# EasyEDA schematic SCH_Satlla_4_Solar_unit_left_2023-01-29.json
TITLE: Solar_Unit_110x50; REV: 1.0; Date: 2021-01-31; Sheet: 1/1; Drawn By: KCG LAB; Company: KCG LAB
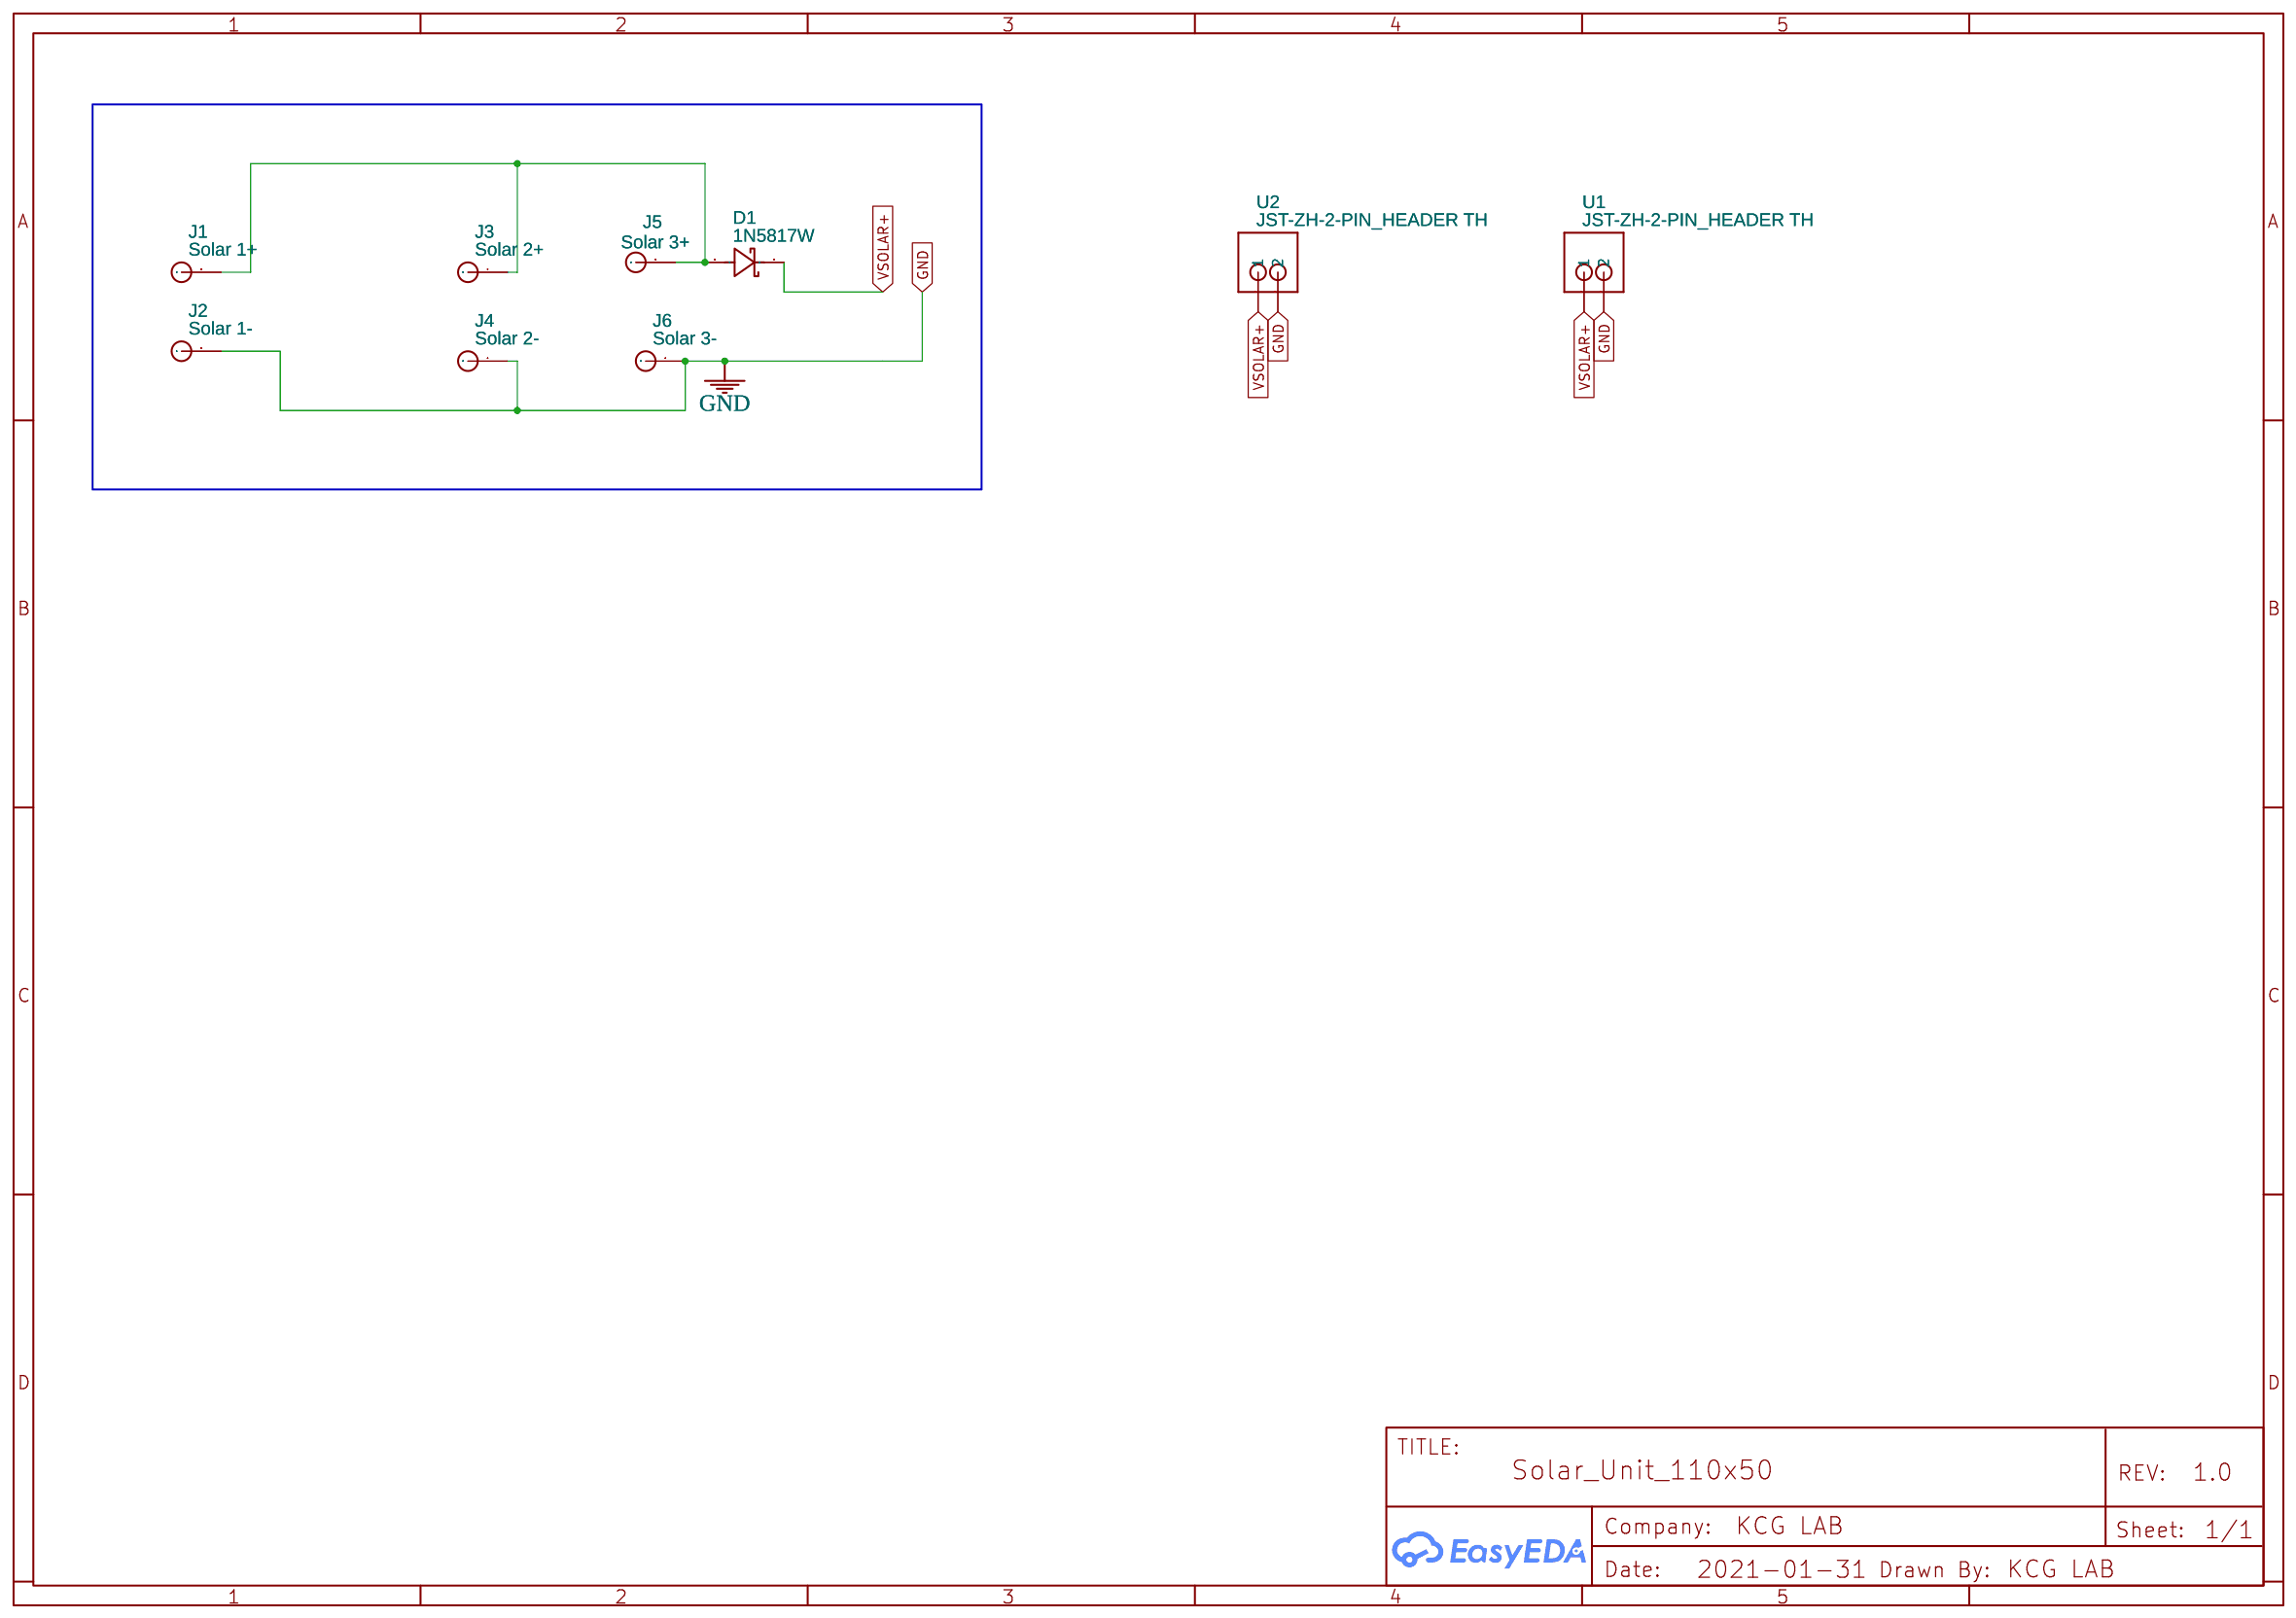
[diagram p0: schematic sheet]

## Parts
D1  1N5817W  [SOD-123_L2.8-W1.8-LS3.7-RD]
J1  Solar 1+  [CONNECTOR]
J2  Solar 1-  [CONNECTOR]
J3  Solar 2+  [CONNECTOR]
J4  Solar 2-  [CONNECTOR]
J5  Solar 3+  [CONNECTOR]
J6  Solar 3-  [CONNECTOR]
U1  JST-ZH-2-PIN_HEADER TH  [JST-ZH-2 1.5MM TH]
U2  JST-ZH-2-PIN_HEADER TH  [JST-ZH-2 1.5MM TH]

## Library data of the parts
D1 = 1N5817W: Supplier: LCSC; Supplier Part: C727113; Manufacturer: TWGMC; Contributor: LCSC; SMT Type: Extend; JLCPCB SMD: Yes; LCSC Assembly: Yes
J1-J6 = Connector: DIP Black Round Female Header VERT;; Supplier Part: 320030026; Supplier: SeeedStudio; Manufacturer Part: RF130-1013BBS0741; sourceId: kPDdb8uQO; Contributor: Jayadamski
U1 U2 = JST-ZH-2-PIN_HEADER TH: Contributor: Herve Goncalves

## Nets
GND: J2.1 J4.1 J6.1 U1.2 U2.2
VSOLAR+: D1.1(C) U1.1 U2.1
Net-(D1-2): D1.2(A) J1.1 J3.1 J5.1
